# EAGLE design nyan-pirate (EAGLE 6.5.0)
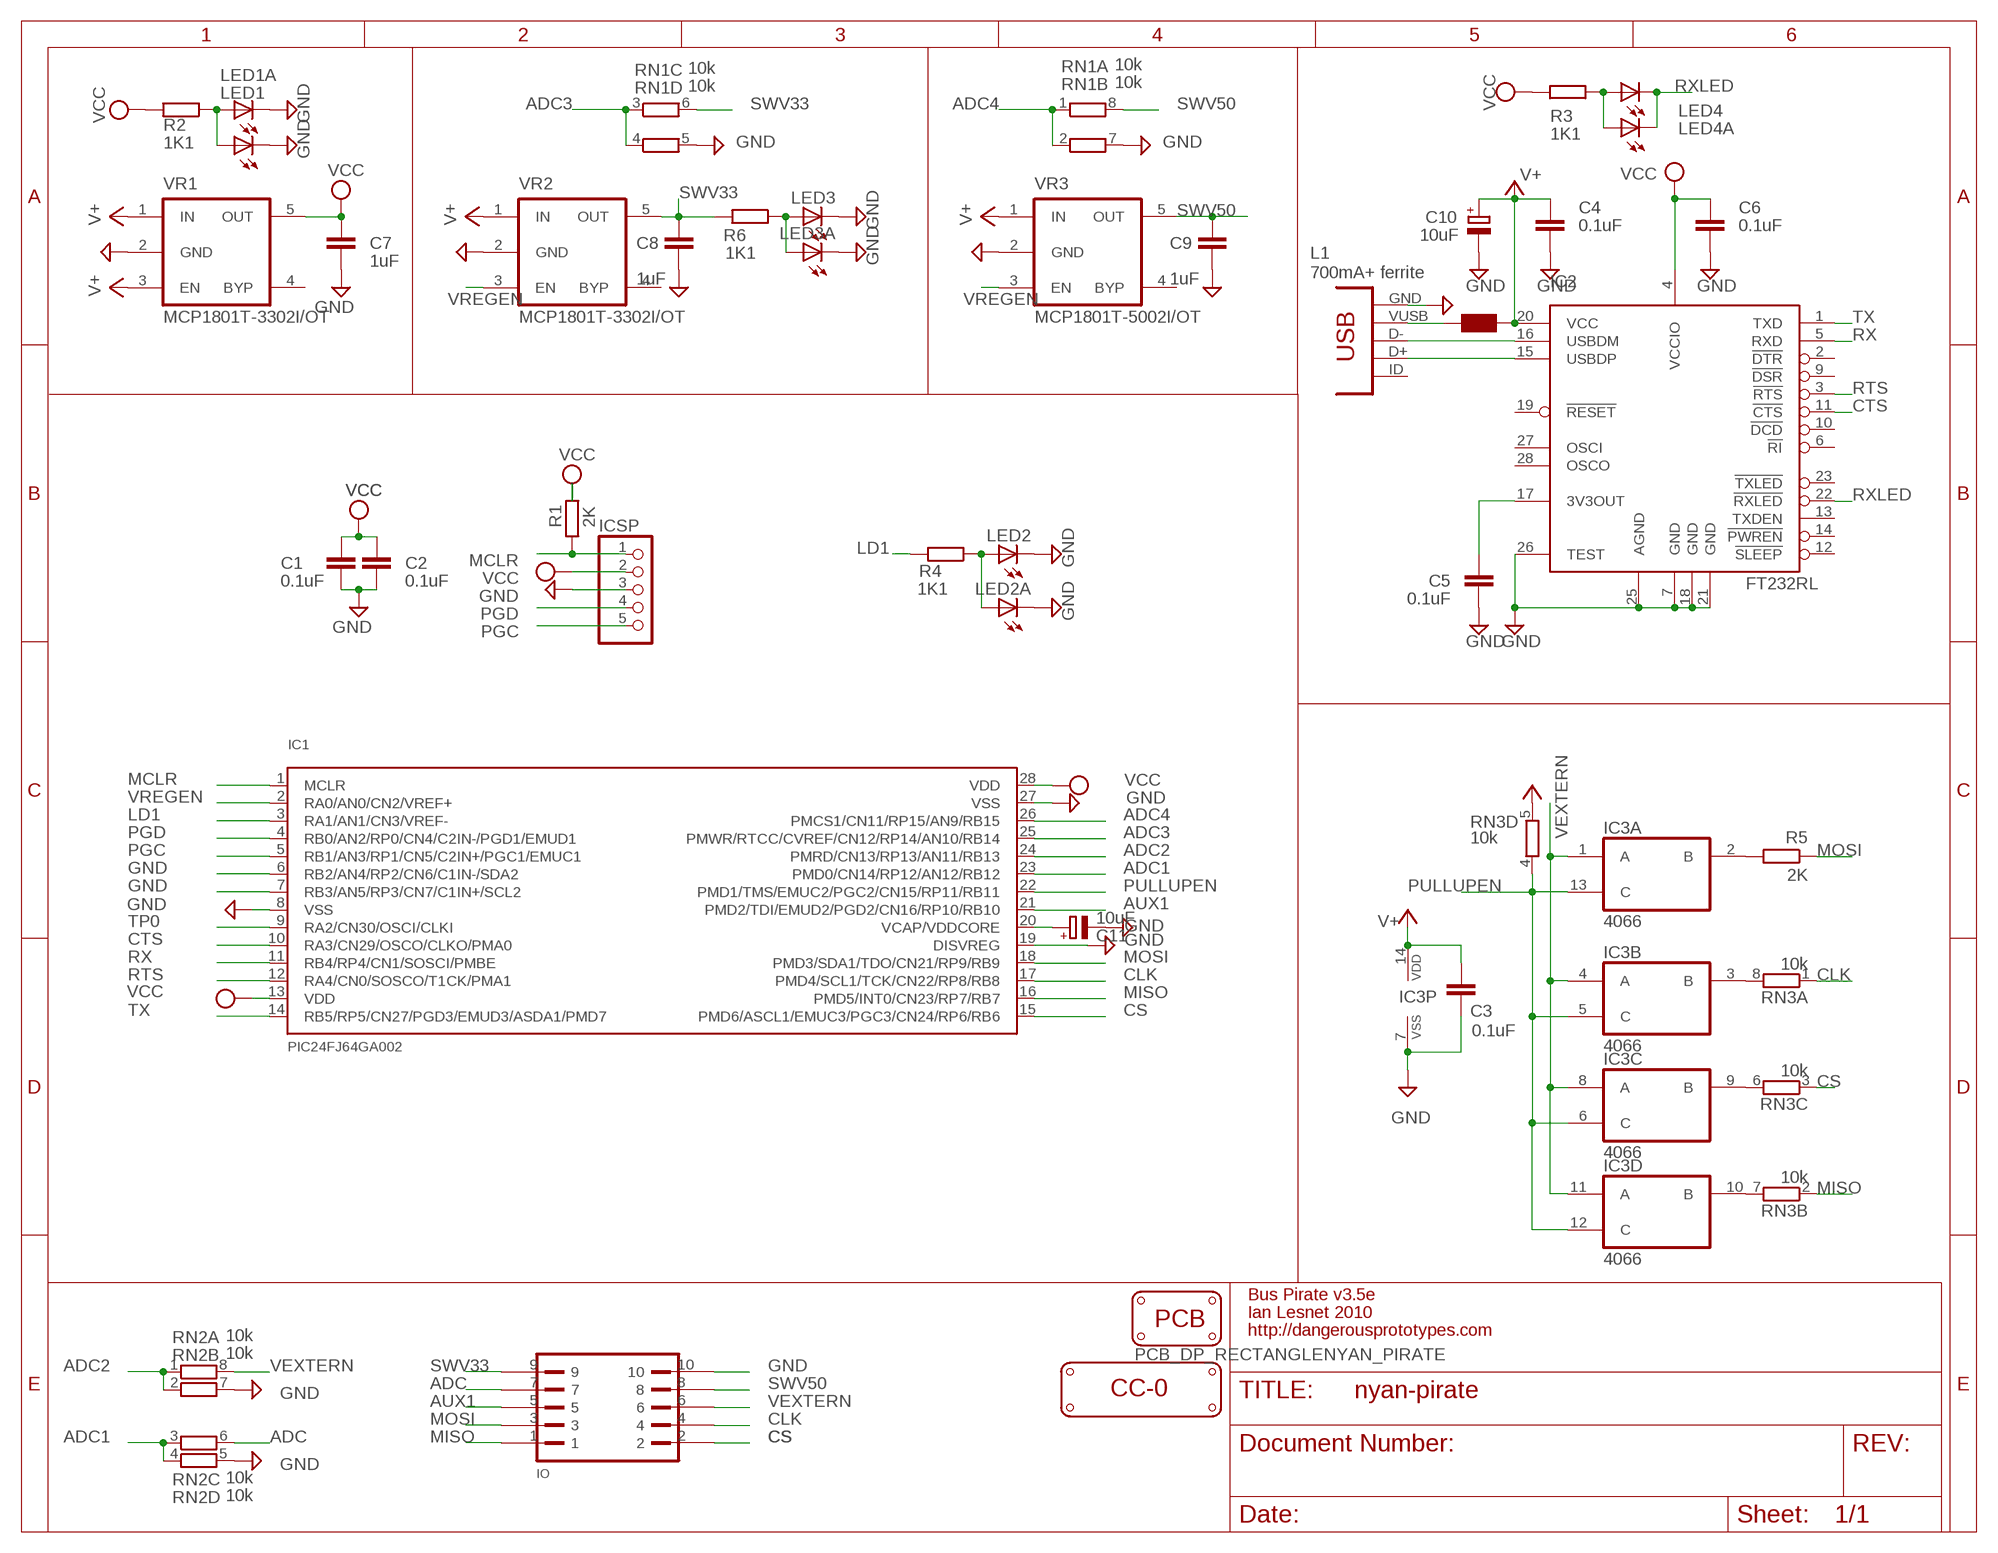
[diagram p0: schematic, sheet 1]

## Parts
C1  0.1uF  CAPC603  [C603]
C2  0.1uF  CAPC603  [C603]
C3  0.1uF  CAPC603  [C603]
C4  0.1uF  CAPC603  [C603]
C5  0.1uF  CAPC603  [C603]
C6  0.1uF  CAPC603  [C603]
C7  1uF  CAPC603  [C603]
C8  1uF  CAPC603  [C603]
C9  1uF  CAPC603  [C603]
C10  10uF  CPOL-EUSMCA  [SMC_A]
C11  10uF  CPOL-EUSMCA  [SMC_A]
IC1  PIC24FJ64GA002  [SSOP28]
IC2  FT232RL  [SSOP28]
IC3  4066  [TSSOP14]
ICSP  PINHD-1X5  [1X05]
IO  HEADER2X5-SHRD-PTH-B  [PINSHRD_PTH_2X05B]
J1  CON-USB-MINI-BUSB1  [CONN_USB_MINI-B]
L1  700mA+ ferrite  WE-KIL_0805  [WE-KI_0805_B]
LED1  LEDCHIP-LED0805  [CHIP-LED0805]
LED1A  LEDCHIP-LED0805  [CHIP-LED0805]
LED2  LEDCHIP-LED0805  [CHIP-LED0805]
LED2A  LEDCHIP-LED0805  [CHIP-LED0805]
LED3  LEDCHIP-LED0805  [CHIP-LED0805]
LED3A  LEDCHIP-LED0805  [CHIP-LED0805]
LED4  LEDCHIP-LED0805  [CHIP-LED0805]
LED4A  LEDCHIP-LED0805  [CHIP-LED0805]
LOGO1  LOGO_CC-0  [LOGO_CC-0]
PCB1  PCB_DP_RECTANGLENYAN_PIRATE  [NYAN_PIRATE]
R1  2K  RESISTORR603  [R603]
R2  1K1  RESISTORR603  [R603]
R3  1K1  RESISTORR603  [R603]
R4  1K1  RESISTORR603  [R603]
R5  2K  RESISTORR603  [R603]
R6  1K1  RESISTORR603  [R603]
RN1  10k  RNETWORK  [RN8P-4R-CRA06S]
RN2  10k  RNETWORK  [RN8P-4R-CRA06S]
RN3  10k  RNETWORK  [RN8P-4R-CRA06S]
VR1  MCP1801T-3302I/OT  MIC5205  [SOT-23-5]
VR2  MCP1801T-3302I/OT  MIC5205  [SOT-23-5]
VR3  MCP1801T-5002I/OT  MIC5205  [SOT-23-5]

## Nets
$N26: J1.VUSB L1.2
ADC: IO.7 RN2.6
ADC1: IC1.23(PMD0/CN14/RP12/AN12/RB12) RN2.3 RN2.4
ADC2: IC1.24(PMRD/CN13/RP13/AN11/RB13) RN2.1 RN2.2
ADC3: IC1.25(PMWR/RTCC/CVREF/CN12/RP14/AN10/RB14) RN1.3 RN1.4
ADC4: IC1.26(PMCS1/CN11/RP15/AN9/RB15) RN1.1 RN1.2
AUX1: IC1.21(PMD2/TDI/EMUD2/PGD2/CN16/RP10/RB10) IO.5
CLK: IC1.17(PMD4/SCL1/TCK/CN22/RP8/RB8) IO.4 RN3.1
CS: IC1.15(PMD6/ASCL1/EMUC3/PGC3/CN24/RP6/RB6) IO.2 RN3.3
CTS: IC1.10(RA3/CN29/OSCO/CLKO/PMA0) IC2.11(!CTS)
GND: C1.2 C2.2 C3.2 C4.2 C5.2 C6.2 C7.2 C8.2 C9.2 C10.- C11.- IC1.6(RB2/AN4/RP2/CN6/C1IN-/SDA2) IC1.7(RB3/AN5/RP3/CN7/C1IN+/SCL2) IC1.8(VSS) IC1.19(DISVREG) IC1.27(VSS) IC2.7(GND) IC2.18(GND) IC2.21(GND) IC2.25(AGND) IC2.26(TEST) IC3.7(P:VSS) ICSP.3 IO.10 J1.GND LED1.C LED1A.C LED2.C LED2A.C LED3.C LED3A.C RN1.5 RN1.7 RN2.5 RN2.7 VR1.2(GND) VR2.2(GND) VR3.2(GND)
LD1: IC1.3(RA1/AN1/CN3/VREF-) R4.2
MCLR: IC1.1(MCLR) ICSP.1 R1.1
MISO: IC1.16(PMD5/INT0/CN23/RP7/RB7) IO.1 RN3.2
MOSI: IC1.18(PMD3/SDA1/TDO/CN21/RP9/RB9) IO.3 R5.1
N$1: IC3.2(A:B) R5.2
N$2: IC3.9(C:B) RN3.6
N$3: C11.+ IC1.20(VCAP/VDDCORE)
N$4: IC3.10(D:B) RN3.7
N$5: IC3.3(B:B) RN3.8
N$6: LED2.A LED2A.A R4.1
N$7: LED1.A LED1A.A R2.1
N$9: C5.1 IC2.17(3V3OUT)
N$13: LED4.A LED4A.A R3.1
N$15: IC2.15(USBDP) J1.D+
N$16: IC2.16(USBDM) J1.D-
N$18: LED3.A LED3A.A R6.1
PGC: IC1.5(RB1/AN3/RP1/CN5/C2IN+/PGC1/EMUC1) ICSP.5
PGD: IC1.4(RB0/AN2/RP0/CN4/C2IN-/PGD1/EMUD1) ICSP.4
PULLUPEN: IC1.22(PMD1/TMS/EMUC2/PGC2/CN15/RP11/RB11) IC3.5(B:C) IC3.6(C:C) IC3.12(D:C) IC3.13(A:C) RN3.4
RTS: IC1.12(RA4/CN0/SOSCO/T1CK/PMA1) IC2.3(!RTS)
RX: IC1.11(RB4/RP4/CN1/SOSCI/PMBE) IC2.5(RXD)
RXLED: IC2.22(!RXLED) LED4.C LED4A.C
SWV33: C8.1 IO.9 R6.2 RN1.6 VR2.5(OUT)
SWV50: C9.1 IO.8 RN1.8 VR3.5(OUT)
TP0: IC1.9(RA2/CN30/OSCI/CLKI)
TX: IC1.14(RB5/RP5/CN27/PGD3/EMUD3/ASDA1/PMD7) IC2.1(TXD)
V+: C3.1 C4.1 C10.+ IC2.20(VCC) IC3.14(P:VDD) L1.1 RN3.5 VR1.1(IN) VR1.3(EN) VR2.1(IN) VR3.1(IN)
VCC: C1.1 C2.1 C6.1 C7.1 IC1.13(VDD) IC1.28(VDD) IC2.4(VCCIO) ICSP.2 R1.2 R2.2 R3.2 VR1.5(OUT)
VEXTERN: IC3.1(A:A) IC3.4(B:A) IC3.8(C:A) IC3.11(D:A) IO.6 RN2.8
VREGEN: IC1.2(RA0/AN0/CN2/VREF+) VR2.3(EN) VR3.3(EN)
Unconnected: IC2.2(!DTR) IC2.6(!RI) IC2.9(!DSR) IC2.10(!DCD) IC2.12(!SLEEP) IC2.13(TXDEN) IC2.14(!PWREN) IC2.19(!RESET) IC2.23(!TXLED) IC2.27(OSCI) IC2.28(OSCO) J1.BODY@1(BODY) J1.BODY@2(BODY) J1.BODY@3(BODY) J1.BODY@4(BODY) J1.ID(USBID) VR1.4(BYP) VR2.4(BYP) VR3.4(BYP)

## Notes on the sheet
- Bus Pirate v3.5e
- Ian Lesnet 2010
- http://dangerousprototypes.com

## Library data of the parts
C1-C9 = dp_devices:CAP
C10 C11 = rcl:CPOL-EU: POLARIZED CAPACITOR, European symbol
IC1 = dp_devices:PIC24FJ64GA002: 16-bit General Purpose Flash Microcontroller
IC2 = dp_devices:FT232RL: USB to serial UART interface
IC3 = 40xx:4066: Quad bilateral ANALOG SWITCH
ICSP = pinhead:PINHD-1X5: PIN HEADER
IO = dp_devices:HEADER2X5-SHRD-PTH: Shrouded pin header, 2.54mm pitch
J1 = dp_devices:CON-USB-MINI-B: USB connector
L1 = wuerth-elektronik:WE-KIL: SMD Wire Wound Ceramic Inductor WE-KIL - Low profile - High Q values -- Bluetooth -- Wireless LAN -- RF oscillation circuit -- IF impedance matching
LED1 LED1A LED2 LED2A LED3 LED3A LED4 LED4A = led:LED: LED OSRAM: - CHIPLED LG R971, LG N971, LY N971, LG Q971, LY Q971, LO R971, LY R971 LH N974, LH R974 LS Q976, LO Q976, LY Q976 LO Q996 - Hyper CHIPLED LW Q18S LB Q993, LB Q99A, LB R99A - SideLED LS A670, LO A670, LY A670, LG A670, LP A670 LB A673, LV A673, LT A673, LW A673 LH A674 LY A675 LS A676, LA A676, LO A676, LY A676, LW A676 LS A679, LY A679, LG A679 - Hyper Micro SIDELED® LS Y876, LA Y876, LO Y876, LY Y876 LT Y87S - SmartLED LW L88C, LW L88S LB L89C, LB L89S, LG L890 LS L89K, LO L89K, LY L89K LS L896, LA L896, LO L896, LY L896 - TOPLED LS T670, LO T670, LY T670, LG T670, LP T670 LSG T670, LSP T670, LSY T670, LOP T670, LYG T670 LG T671, LOG T671, LSG T671 LB T673, LV T673, LT T673, LW T673 LH T674 LS T676, LA T676, LO T676, LY T676, LB T676, LH T676, LSB T676, LW T676 LB T67C, LV T67C, LT T67C, LS T67K, LO T67K, LY T67K, LW E67C LS E67B, LA E67B, LO E67B, LY E67B, LB E67C, LV E67C, LT E67C LW T67C LS T679, LY T679, LG T679 LS T770, LO T770, LY T770, LG T770, LP T770 LB T773, LV T773, LT T773, LW T773 LH T774 LS E675, LA E675, LY E675, LS T675 LS T776, LA T776, LO T776, LY T776, LB T776 LHGB T686 LT T68C, LB T68C - Hyper Mini TOPLED® LB M676 - Mini TOPLED Santana® LG M470 LS M47K, LO M47K, LY M47K Source: http://www.osram.convergy.de LUXEON: - LUMILED® LXK2-PW12-R00, LXK2-PW12-S00, LXK2-PW14-U00, LXK2-PW14-V00 LXK2-PM12-R00, LXK2-PM12-S00, LXK2-PM14-U00 LXK2-PE12-Q00, LXK2-PE12-R00, LXK2-PE12-S00, LXK2-PE14-T00, LXK2-PE14-U00 LXK2-PB12-K00, LXK2-PB12-L00, LXK2-PB12-M00, LXK2-PB14-N00, LXK2-PB14-P00, LXK2-PB14-Q00 LXK2-PR12-L00, LXK2-PR12-M00, LXK2-PR14-Q00, LXK2-PR14-R00 LXK2-PD12-Q00, LXK2-PD12-R00, LXK2-PD12-S00 LXK2-PH12-R00, LXK2-PH12-S00 LXK2-PL12-P00, LXK2-PL12-Q00, LXK2-PL12-R00 Source: www.luxeon.com KINGBRIGHT: KA-3528ASYC Source: www.kingbright.com
LOGO1 = dp_devices:LOGO_CC-0
PCB1 = dp_pcb:PCB_DP_RECTANGLE: Dangerous Prototypes Standard Rectangular PCB sizes
R1-R6 = dp_devices:RESISTOR
RN1-RN3 = dp_devices:RNETWORK: 4 Resistor Array 0603
VR1-VR3 = dp_devices:MIC5205: 150ma Low-Noise LDO Regulator

## Board
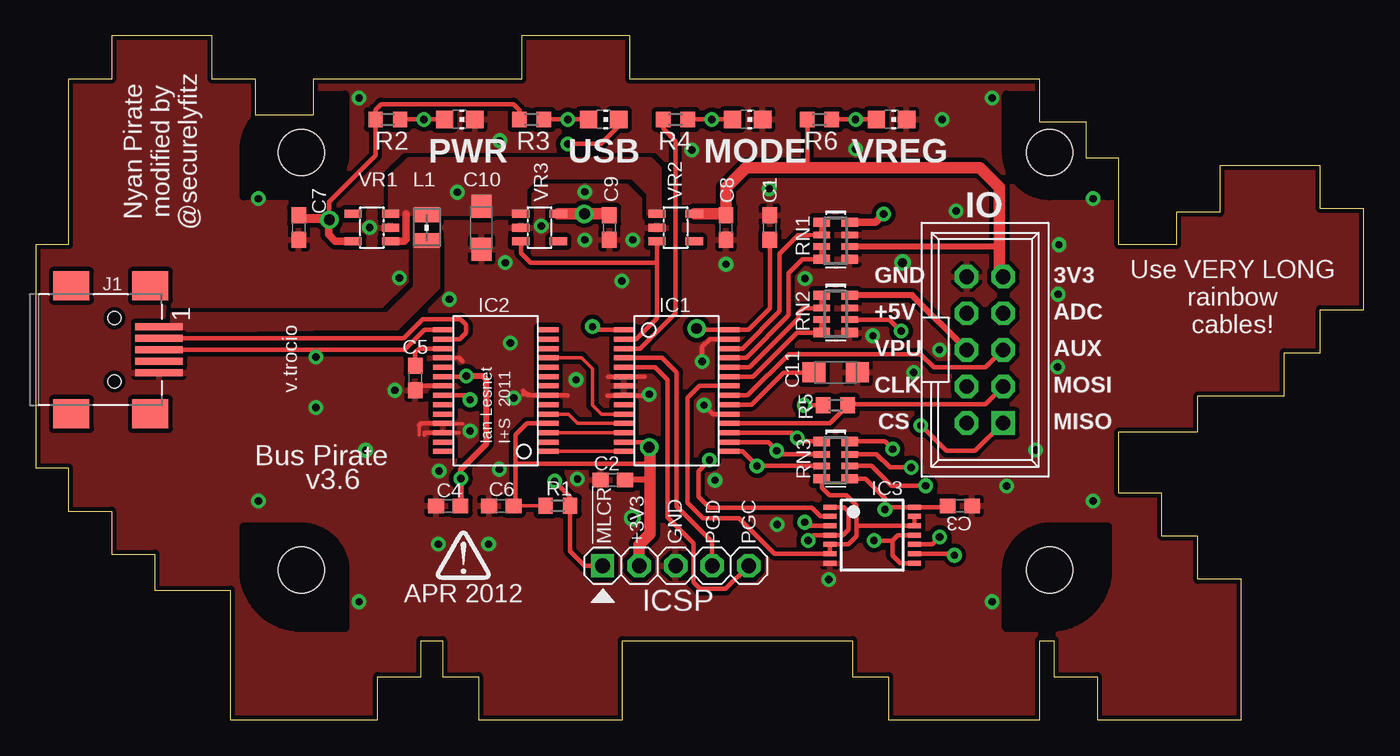
[diagram p1: board, top side]
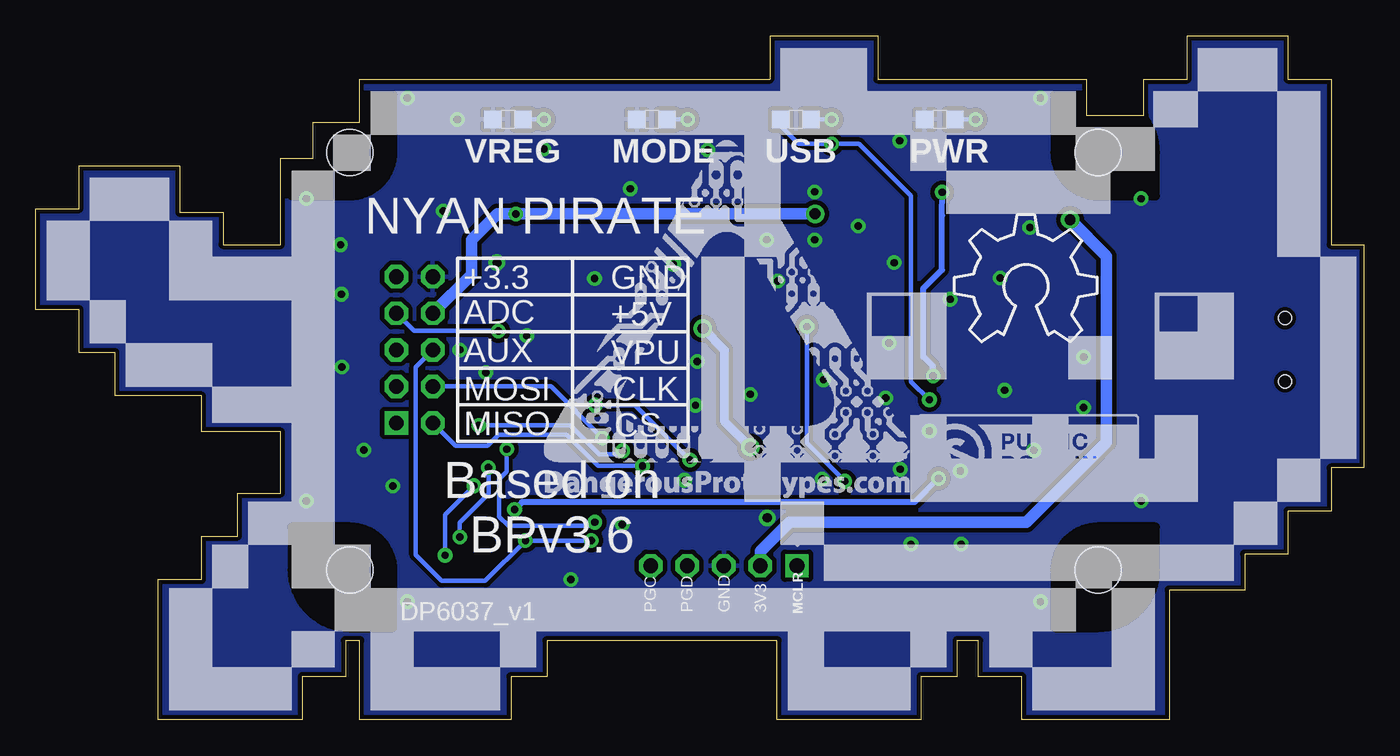
[diagram p2: board, bottom side, seen from below]

Size 92.25 x 47.5 mm. Coordinates in mm from the lower left corner, seen from the top.
Copper layers (1*16): Top 0.035mm / dielectric 1.5mm / Bottom 0.035mm
Design rules "SparkFun": minimum track width 8mil, minimum drill 20mil, track to track 8mil, track to pad 8mil, pad to pad 8mil, via to via 8mil, smd to smd 8mil, copper to edge 10mil, drill to drill 8mil, minimum pad ring 12mil, minimum via ring 10mil, stop-mask expansion 4mil, vias tented up to drill 25mil, thermal gap 10mil

### Footprints (pad centres in the part's own frame; a part is rotated, then mirrored left to right if it is on the bottom)
C603 = smd 1.1 x 1: 1 -0.85,0; 2 0.85,0
SMC_A = smd 1.6 x 1.4: + -1.5,0; - 1.5,0
SSOP28 = smd 0.348 x 1.397: 1 -4.225,-3.656; 2 -3.575,-3.656; 3 -2.925,-3.656; 4 -2.275,-3.656; 5 -1.625,-3.656; 6 -0.975,-3.656; 7 -0.325,-3.656; 8 0.325,-3.656; 9 0.975,-3.656; 10 1.625,-3.656; 11 2.275,-3.656; 12 2.925,-3.656; 13 3.575,-3.656; 14 4.225,-3.656; 15 4.225,3.656; 16 3.575,3.656; 17 2.925,3.656; 18 2.275,3.656; 19 1.625,3.656; 20 0.975,3.656; 21 0.325,3.656; 22 -0.325,3.656; 23 -0.975,3.656; 24 -1.625,3.656; 25 -2.275,3.656; 26 -2.925,3.656; 27 -3.575,3.656; 28 -4.225,3.656
TSSOP14 = smd 0.35 x 0.9: 1 -1.95,-2.925; 2 -1.3,-2.925; 3 -0.65,-2.925; 4 0,-2.925; 5 0.65,-2.925; 6 1.3,-2.925; 7 1.95,-2.925; 8 1.95,2.925; 9 1.3,2.925; 10 0.65,2.925; 11 0,2.925; 12 -0.65,2.925; 13 -1.3,2.925; 14 -1.95,2.925
1X05 = drill 1.016 square: 1 -5.08,0 | drill 1.016 octagon: 2 -2.54,0; 3 0,0; 4 2.54,0; 5 5.08,0
PINSHRD_PTH_2X05B = drill 1.016 square: 1 -5.08,-1.27 | drill 1.016 octagon: 2 -5.08,1.27; 3 -2.54,-1.27; 4 -2.54,1.27; 5 0,-1.27; 6 0,1.27; 7 2.54,-1.27; 8 2.54,1.27; 9 5.08,-1.27; 10 5.08,1.27
CONN_USB_MINI-B = smd 2 x 2.5: BODY@1 -4.45,2.5; BODY@2 4.45,2.5; BODY@3 4.45,-3; BODY@4 -4.45,-3 | smd 0.5 x 3.3: D+ 0,3.1; D- -0.8,3.1; GND 1.6,3.1; ID 0.8,3.1; VUSB -1.6,3.1 | hole 0.9: -2.2,0; 2.2,0
WE-KI_0805_B = smd 1.02 x 1.78: 1 -0.89,0; 2 0.89,0
CHIP-LED0805 = smd 1.2 x 1.2: A 0,-1.05; C 0,1.05
NYAN_PIRATE = hole 3.2: 22.2,13.4; 74.2,13.4; 74.2,42.4; 22.2,42.4
R603 = smd 1 x 1.1: 1 -0.85,0; 2 0.85,0
RN8P-4R-CRA06S = smd 0.63 x 1.15: 1 -1.295,-0.975; 4 1.295,-0.975; 5 1.295,0.975; 8 -1.295,0.975 | smd 0.44 x 1.15: 2 -0.4,-0.975; 3 0.4,-0.975; 6 0.4,0.975; 7 -0.4,0.975
SOT-23-5 = smd 0.55 x 1.2: 1 -0.95,-1.3; 2 0,-1.3; 3 0.95,-1.3; 4 0.95,1.3; 5 -0.95,1.3

### Placement (x,y rotation side)
C1  51,34.19 90 top
C2  40.07,16.66 180 top
C3  64.2,14.86 0 top
C4  28.64,14.86 180 top
C5  26.36,23.75 270 top
C6  32.33,14.86 180 top
C7  18.26,34.19 270 top
C8  47.95,34.19 270 top
C9  39.85,34.19 270 top
C10  30.96,34.19 270 top
C11  55.57,24.13 0 top
IC1  44.52,22.86 270 top
IC2  31.94,22.86 90 top
IC3  58.11,12.83 270 top
ICSP  44.45,10.7 0 top
IO  65.95,25.7 90 top
J1  5.45,25.7 270 top
L1  27.15,34.19 270 top
LED1  29.45,41.7 270 top
LED1A  29.45,41.7 90 bottom
LED2  49.45,41.7 270 top
LED2A  49.45,41.7 90 bottom
LED3  59.45,41.7 270 top
LED3A  59.45,41.7 90 bottom
LED4  39.45,41.7 270 top
LED4A  39.45,41.7 90 bottom
LOGO1  30.95,15.82 0 bottom
PCB1  -3.75,-3 0 top
R1  36.26,14.86 180 top
R2  24.45,41.7 180 top
R3  34.45,41.7 180 top
R4  44.45,41.7 180 top
R5  55.57,21.85 180 top
R6  54.45,41.7 180 top
RN1  55.57,33.28 270 top
RN2  55.57,28.2 270 top
RN3  55.57,18.04 270 top
U$1  [DP-LOGO]  27.79,9.74 0 top
U$2  [OSHW_8X350_NOTEXT]  28.42,26.25 0 bottom
U$3  [DP_LOGO_ART_1X1]  56.94,15.44 0 bottom
VR1  23.34,34.19 90 top
VR2  44.45,34.19 270 top
VR3  34.99,34.19 270 top

### Tracks (layer width: path | path; a pad name or v marks a point on that pad's centre or on a via)
$N26
  pour Top (isolate 0.305, no thermals): 21.28,27.2 9.45,27 9.45,28.15 24.45,28.15 26.36,30.06 26.36,33.08 26.52,33.23 27.79,33.23 27.94,33.08 27.94,30.06 25.09,27.2
ADC  (via drill 0.51)
  Top 0.305: RN2.6 59.32,27.8 v60.11,27
  Bottom 0.305: v60.11,27 60.3,27.01 65.98,27.01 IO.7
ADC1
  Top 0.305: RN2.3 RN2.4 52.9,26.9 49.83,23.84 IC1.23
ADC2
  Top 0.305: RN2.1 RN2.2 53.32,28.6 52.99,28.26 52.99,27.88 49.59,24.49 IC1.24
ADC3
  Top 0.305: RN1.3 RN1.4 53.25,31.98 52.3,31.03 52.3,28.09 49.36,25.14 IC1.25
ADC4
  Top 0.305: RN1.1 RN1.2 53.67,33.65 52.94,33.65 51.67,32.38 51.67,28.36 49.09,25.79 IC1.26
AUX1
  Top 0.305: IC1.21 49.45,22.54 52.31,25.4 61.46,25.4 62.39,24.47 65.98,24.47 IO.5
CLK  (via drill 0.51)
  Top 0.305: IC1.17 52.55,19.94 v52.9,19.59 53.15,19.33 RN3.1
  Bottom 0.305: v52.9,19.59 56.47,23.16 IO.4
CS  (via drill 0.51)
  Top 0.305: v50.11,17.64 RN3.3 | v50.11,17.64 50.25,17.64 | v50.11,17.64 49.11,18.64 IC1.15
  Bottom 0.305: v50.11,17.64 53.21,17.64 55.39,19.81 60.09,19.81 60.85,19.05 63.1,19.05 IO.2
CTS
  Top 0.254: IC2.11 37.93,25.14 38.68,24.39 38.68,21.85 39.29,21.24 IC1.10
GND  (via drill 0.51, 0.64)
  Top 0.254: 29.42,25.14 IC2.18 | 26.61,19.81 26.61,20.45 | 28.13,20.58 29.66,20.58 | 28.26,19.94 28.26,20.07 | 28.26,19.94 29.4,19.94 | IC2.26 28.27,19.94 28.26,19.94
  Top 0.305: 34.18,22.54 34.25,22.61 34.1,22.61 | 34.1,22.61 33.85,22.61 | 34.18,22.54 IC2.7 | 34.1,22.61 33.85,22.86 | 34.1,22.61 34.18,22.54 | 29.66,24.89 29.42,25.14 | IC2.21 26.48,23.19 C5.2 | IC2.25 26.75,20.59 26.61,20.45 | IC2.26 26.99,19.94 26.99,19.81 | v46.3,24.89 46.3,25.91 46.82,26.44 IC1.27 48.05,26.44 | IC1.19 47.03,21.24 v46.42,21.85 | 42.28,23.83 39.74,23.83 39.75,23.84 IC1.6 | 39.72,22.51 42.51,22.51 | 35.37,22.53 36.9,22.53 36.92,22.51
  other vias: 35.12,34.29 23.18,34.19 22.45,8.2 27.95,12.2 31.45,12.2 15.45,15.2 66.45,8.2 73.45,15.2 69.46,18.75 70.98,24.51 71.04,29.56 71.09,33 73.45,36.2 63.95,35.33 50.96,36.89 56.95,39.65 66.45,43.2 45.57,39.59 32.23,40.22 32.96,26.16 33.22,22.36 32.2,17.4 28.01,17.27 22.9,18.72 24.93,22.89 25.25,30.69 28.72,29.21 47.19,16.64 30.17,20.07 67.45,16.23 55.09,9.74 61,24.13 62.78,25.7 58.16,26.67 37.53,23.62 42.61,22.61 51.51,13.56 53.43,30.65 47.95,31.65 40.71,30.48 15.45,36.2 22.45,43.2 62.96,41.7 60.22,31.75 41.44,14.03 32.61,31.75 38.14,33.34 41.47,33.34 38.14,36.67 37.63,16.72 19.45,21.7 19.45,25.2
  pour Top (isolate 0.305, rank 6): -23.55,97.2 96.45,97.2 96.45,-22.8 -23.55,-22.8
  pour Bottom (isolate 0.305): -23.55,97.2 96.45,97.2 96.45,-22.8 -23.55,-22.8
LD1
  Top 0.305: IC1.3 41.98,25.79 44.45,28.26 44.45,40.2 43.6,41.05 R4.2
MCLR  (via drill 0.51)
  Top 0.305: IC1.1 38.9,27.09 v38.68,27.31 | ICSP.1 38.12,10.7 37.11,11.71 R1.1 37.11,15.49 v36.04,16.57
  Bottom 0.305: v38.68,27.31 38.68,19.2 v36.04,16.57
MISO  (via drill 0.51)
  Top 0.305: v61.49,20.45 63.27,18.67 65.26,18.67 IO.1 | IC1.16 50.89,19.29 v51.48,18.69 | v51.48,18.69 51.38,18.8 | v51.48,18.69 51.74,18.44 RN3.2
  Bottom 0.305: v61.49,20.45 55.13,20.45 53.12,18.44 51.74,18.44 v51.48,18.69
MOSI
  Top 0.305: IO.3 65.98,21.93 56.55,21.93 56.43,21.85 R5.1 55.16,20.59 IC1.18
N$1  (via drill 0.51)
  Top 0.305: v53.38,21.85 R5.2 | IC3.2 54.52,14.13 53.92,14.73 46.8,14.73 46.04,15.5 46.04,17.27 v46.8,18.04
  Bottom 0.305: v53.38,21.85 50.61,21.85 v46.8,18.04
N$2  (via drill 0.51)
  Top 0.305: IC3.9 63.73,11.53 v63.82,11.43 | RN3.6 58.05,17.64 59.43,16.26 v61.82,16.26
  Bottom 0.305: v61.82,16.26 63.82,14.26 v63.82,11.43
N$3
  Top 0.305: IC1.20 49.71,21.89 51.95,24.12 54.06,24.12 C11.+
N$4  (via drill 0.51)
  Top 0.305: IC3.10 62.28,12.18 v62.81,12.7 | v60.81,17.53 59.33,17.53 58.42,18.44 RN3.7
  Bottom 0.305: v60.81,17.53 60.81,15.7 62.81,13.7 v62.81,12.7
N$5  (via drill 0.51)
  Top 0.305: IC3.3 53.65,13.48 v53.41,13.72 | RN3.8 59,19.33 v59.54,18.8
  Bottom 0.305: v53.41,13.72 53.66,13.46 59.43,13.46 60.08,14.11 60.08,16.71 59.54,17.24 v59.54,18.79 v59.54,18.8
N$6  (via drill 0.51)
  Top 0.305: R4.1 v46.95,41.7 LED2A.A
  Bottom 0.305: v46.95,41.7 LED2A.A
N$7  (via drill 0.51)
  Top 0.305: R2.1 v26.95,41.7 LED1A.A
  Bottom 0.305: v26.95,41.7 LED1A.A
N$9
  Top 0.305: IC2.17 26.61,25.79 26.36,25.53 C5.1
N$13  (via drill 0.51)
  Top 0.305: R3.1 v36.95,41.7 LED4A.A
  Bottom 0.305: v36.95,41.7 LED4A.A
N$15
  Top 0.305: IC2.15 27,27.09 26.38,26.46 26.37,26.46 25.61,25.7 J1.D+
N$16
  Top 0.254: IC2.16 28.31,26.42
  Top 0.305: IC2.16 29.45,26.44 29.9,26.89 29.9,27.43 29.49,27.83 26.88,27.83 25.55,26.5 J1.D-
N$18  (via drill 0.51)
  Top 0.305: R6.1 v56.95,41.7 LED3A.A
  Bottom 0.305: v56.95,41.7 LED3A.A
PGC
  Top 0.305: IC1.5 43.02,24.49 43.88,23.62 43.88,14.08 45.69,12.28 45.69,9.55 46.14,9.1 47.93,9.1 ICSP.5
PGD
  Top 0.305: IC1.4 43.51,25.14 44.52,24.13 44.52,14.83 46.99,12.36 ICSP.4
PULLUPEN
  Top 0.305: 57.01,13.46 57.01,12.74 56.46,12.2 55.2,12.2 IC3.5 IC3.6 51.32,11.53 48.85,14 46.35,14 45.28,15.07 45.28,22.36 46.11,23.19 IC1.22 | 57.01,13.46 57.02,13.48 IC3.12 IC3.13 | 57.01,13.46 57.01,14.9 56.32,15.59 55.15,15.59 54.62,16.12 RN3.4
RTS
  Top 0.254: IC2.3 IC1.12
RX
  Top 0.254: IC2.5 37,21.24 37.65,20.59 IC1.11
RXLED  (via drill 0.51)
  Top 0.305: IC2.22 29.84,22.54 v30.17,22.23 | v36.95,40 39.25,40 40.5,41.25 LED4A.C
  Bottom 0.305: v30.17,22.23 31.44,23.5 31.44,36.39 35.05,40 v36.95,40 39.25,40 40.5,41.25 LED4A.C
SWV33
  Top 0.305: 59,38.42 58.94,38.42 59,38.36 | R6.2 53.6,38.61 53.35,38.36
  Top 0.406: RN1.6 66.8,32.88 66.95,33.02
  Top 0.508: 47.85,35.14 C8.1
  Top 0.813: C8.1 47.95,36.96 49.34,38.36 53.35,38.36 59,38.36 65.59,38.36 66.95,36.99 66.95,33.02 66.95,31.03 IO.9 | VR2.5 47.85,35.14
SWV50  (via drill 0.51, 0.76)
  Top 0.508: RN1.8 58.33,34.57 v58.9,35.14 | 39.78,35.18 39.81,35.18 39.85,35.14
  Top 0.61: 39.78,35.18 C9.1
  Top 0.813: VR3.5 37.22,35.14 v38.1,35.14 39.85,35.14
  Bottom 0.813: v38.1,35.14 v58.9,35.14 60.17,35.14 61.98,33.33 61.98,30.92 IO.8
TX
  Top 0.254: IC2.1 IC1.14
V+  (via drill 0.51)
  Top 0.305: IC2.20 29.87,23.84 v29.91,23.88 | C3.1 63.27,14.78 IC3.14 59.08,14.78 v59,14.61 | 56.58,16.73 57.64,16.73 58.98,15.38 58.98,14.62
  Top 0.406: v29.53,16.77 29.53,15.56 C4.1 29.53,14.9 v29.53,16.77 | v29.53,16.77 29.53,17.4 31.31,19.18 31.31,23.62 31.06,23.88 v29.91,23.88 | 56.58,16.73 RN3.5 | v59,14.61 58.98,14.62
  Top 0.508: VR1.1 25.56,33.24 25.72,33.39 25.72,35.14
  Bottom 0.406: v29.53,16.77 31.18,15.12 58.49,15.12 v59,14.61 | v29.91,23.88 29.91,24.54 30.58,25.21 30.58,29.96 29.29,31.26 29.29,35.04 v29.28,36.64
  pour Top (isolate 0.305, no thermals): 24.61,37.68 24.61,35.14 33.98,35.14 33.98,36.89 34.77,37.68 41.44,37.68 42.55,36.57 42.55,35.14 43.34,35.14 43.34,38.32 42.71,38.95 25.88,38.95
VCC  (via drill 0.76)
  Top 0.254: C6.1 R1.2
  Top 0.305: 42.76,19.29 v42.61,18.93 42.25,19.29 IC1.13 | v45.92,27.18 46.01,27.09 IC1.28 49.51,27.09 51,28.58 C1.1 | 42.68,17.77 33.34,17.77 | 33.34,17.77 33.34,15.03 C6.1 | IC2.4 34.12,20.59 33.34,19.81 33.34,17.77 | v20.4,34.75 v20.39,34.74 20.39,36 23.6,39.21 R2.2 23.6,42.39 23.97,42.76 33.18,42.76 33.6,42.34 R3.2
  Top 0.406: C2.1 42.55,16.66 42.68,16.54
  Top 0.508: 20.45,34.8 v20.39,34.74 20.32,34.67 20.32,33.71 20.8,33.24 VR1.5
  Top 0.61: 42.68,18.86 v42.61,18.93 | v20.39,34.74 20.39,34.8 | 20.32,34.8 18.23,34.8 C7.1
  Top 0.813: v20.39,34.74 20.32,34.8 | 42.68,18.86 42.68,17.77 42.68,16.54 42.68,12.93 41.91,12.16 ICSP.2
  Bottom 0.61: v42.61,18.93 44.39,20.7 44.39,25.66 v45.92,27.18
  Bottom 0.813: v20.39,34.74 17.86,32.21 17.86,19.29 23.44,13.72 39.89,13.72 41.91,11.7 ICSP.2
VEXTERN  (via drill 0.51)
  Top 0.305: IC3.8 60.06,10.88 59.5,11.43 59.5,12.45 | IC3.11 59.89,12.83 59.5,12.45 | IC3.1 56.16,14.78 56.46,14.48 56.46,13.21 56.08,12.83 IC3.4 54.04,12.83 v53.66,12.45 | v58.23,12.45 59.5,12.45
  Top 0.406: RN2.8 60.87,29.49 IO.6
  Bottom 0.305: v53.66,12.45 v58.23,12.45 61.03,9.66 64.06,9.66 65.87,11.46 65.87,24.5 IO.6
VREGEN
  Top 0.305: 33.69,32.42 34.36,31.75 43.15,31.75 | IC1.2 41.68,26.44 43.15,27.91 43.15,31.75 | 33.69,32.42 VR3.3 | 33.69,32.42 | 43.15,31.75 VR2.3

### Text on the board
tPlace: GND | 3V3 | +5V | ADC | VPU | AUX | CLK | MOSI | CS | MISO | !MLCR | +3V3 | GND | PGD | PGC
tNames: Nyan Pirate / modified by / @securelyfitz | PWR | USB | MODE | VREG | Use VERY LONG / rainbow / cables! | v.trocio | 2011 | Ian Lesnet | I+S | Bus Pirate | v3.6 | APR 2012
bNames: PWR | USB | MODE | VREG | NYAN PIRATE | GND | +3.3 | +5V | ADC | VPU | AUX | CLK | MOSI | MISO | CS | Based on / BPv3.6 | MCLR | 3V3 | GND | PGD | PGC
Reference: GND | +3v | +5v | ADC | USB | Vpu | AUX | CLK | MOSI | CS | MISO | I/O header | MCLR | +3.3V | GND | DATA | CLOCK | Bus Pirate v3.6 | Ian Lesnet | CC-0 | APR 2012 | Programming Header | http://dangerousprototypes.com